# EAGLE design DMFX-2 v1.0 (EAGLE 6.3)
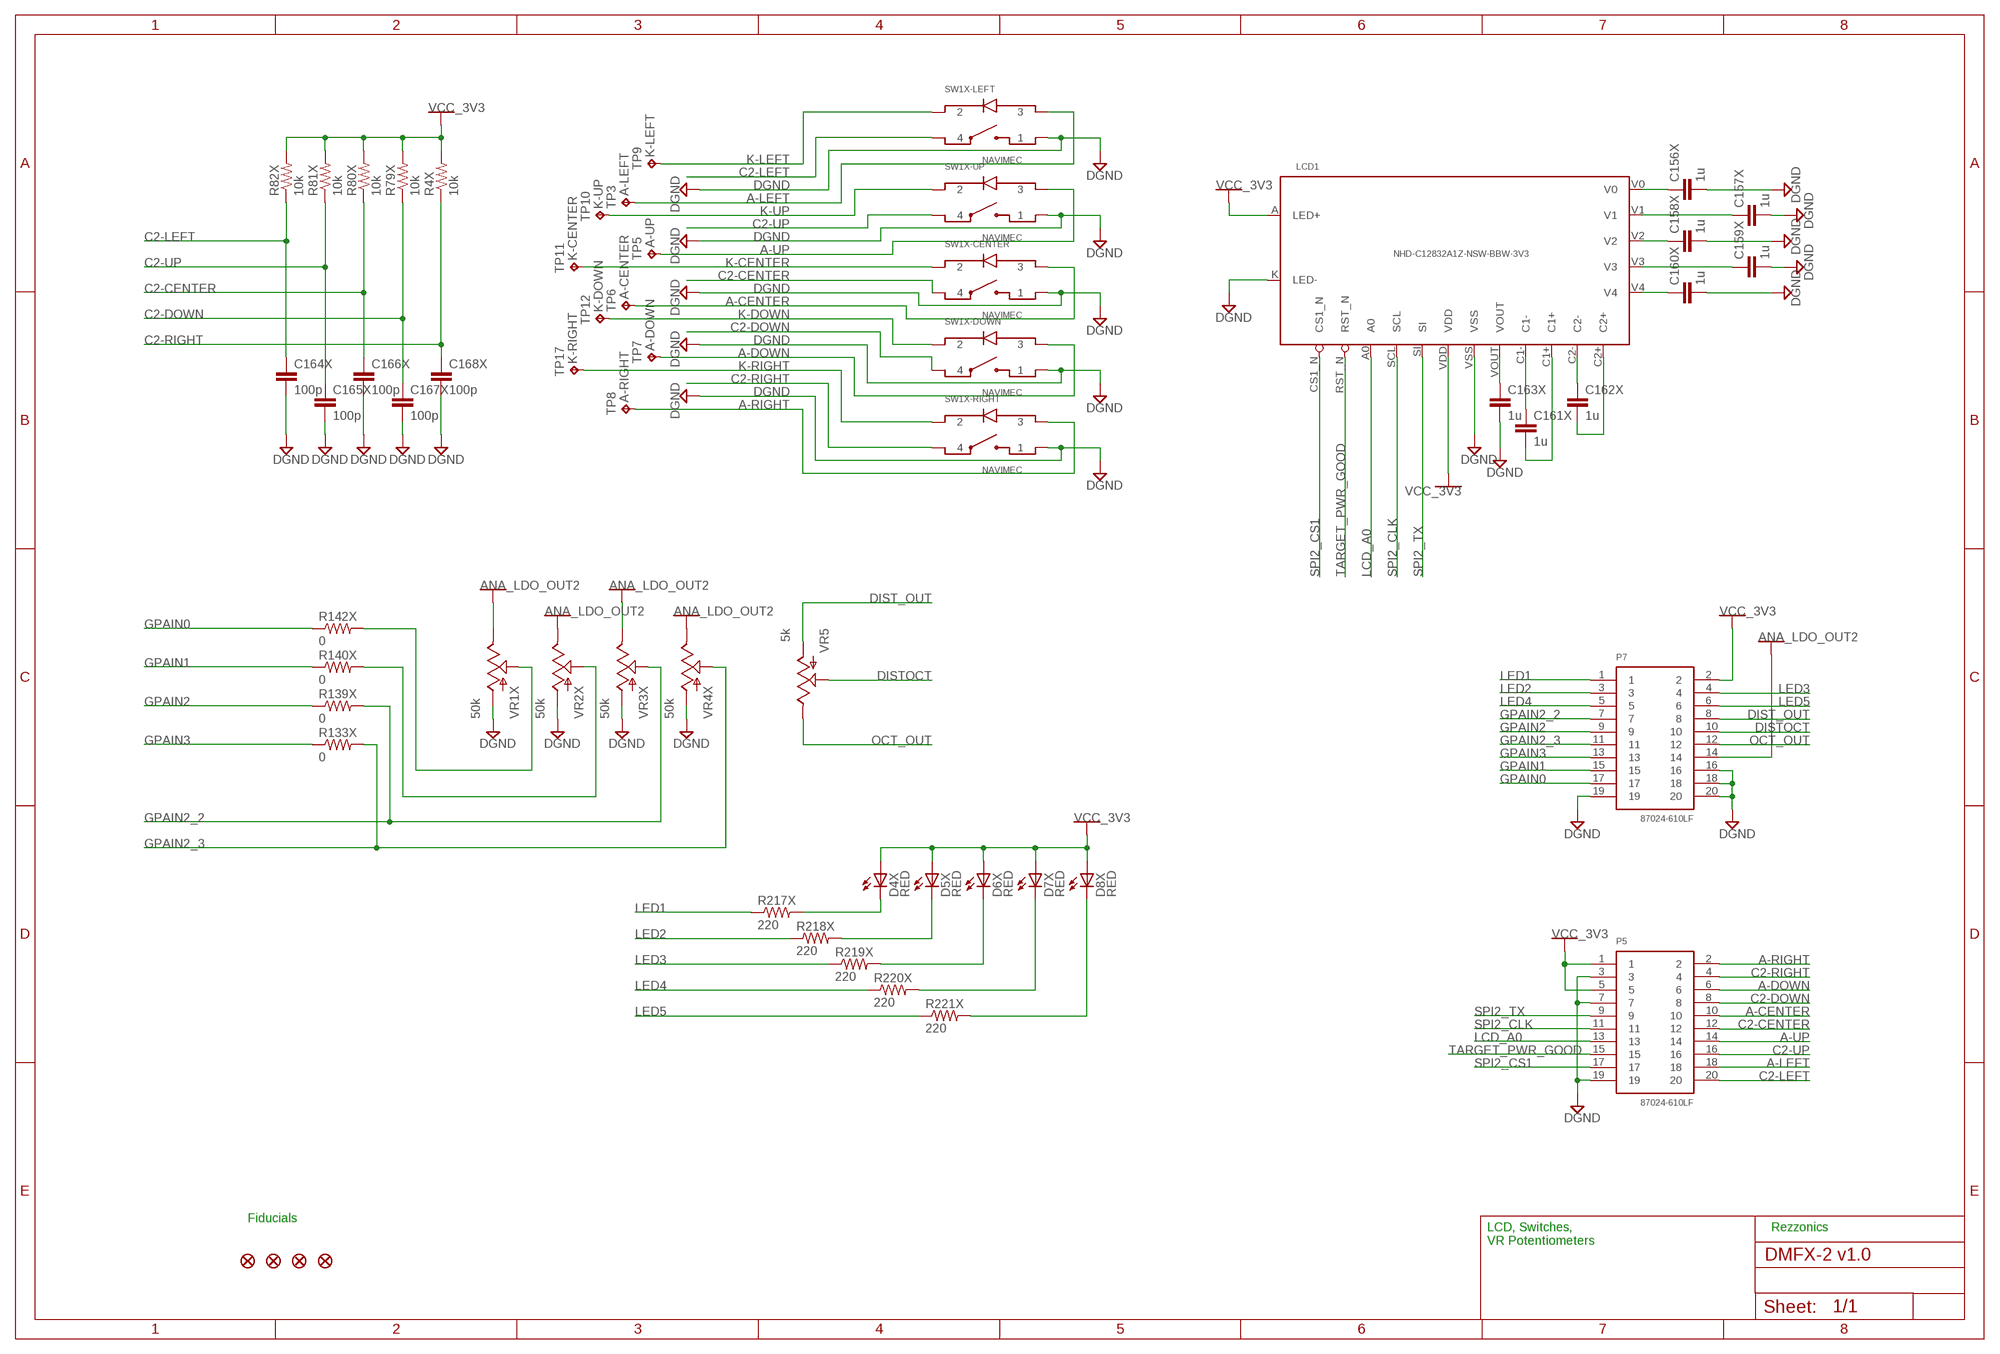
[diagram p0: schematic, sheet 1]

## Parts
C156X  1u  C-EUC0603K  [C0603K]
C157X  1u  C-EUC0603K  [C0603K]
C158X  1u  C-EUC0603K  [C0603K]
C159X  1u  C-EUC0603K  [C0603K]
C160X  1u  C-EUC0603K  [C0603K]
C161X  1u  C-EUC0603K  [C0603K]
C162X  1u  C-EUC0603K  [C0603K]
C163X  1u  C-EUC0603K  [C0603K]
C164X  100p  C-EUC0402  [C0402]
C165X  100p  C-EUC0402  [C0402]
C166X  100p  C-EUC0402  [C0402]
C167X  100p  C-EUC0402  [C0402]
C168X  100p  C-EUC0402  [C0402]
D4X  RED  LED3MM  [LED3MM]
D5X  RED  LED3MM  [LED3MM]
D6X  RED  LED3MM  [LED3MM]
D7X  RED  LED3MM  [LED3MM]
D8X  RED  LED3MM  [LED3MM]
JP2  FIDUCIAL1X2.5  [FIDUCIAL-1X2.5]
JP4  FIDUCIAL1X2.5  [FIDUCIAL-1X2.5]
JP5  FIDUCIAL1X2.5  [FIDUCIAL-1X2.5]
JP9  FIDUCIAL1X2.5  [FIDUCIAL-1X2.5]
LCD1  NHD-C12832A1Z-NSW-BBW-3V3  NHD-C12832A1Z  [NHD-C12832A1Z]
P5  87024-610LF  87022-110LF  [87022-110LF]
P7  87024-610LF  87022-110LF  [87022-110LF]
R4X  10k  RESISTOR0402-RES  [0402-RES]
R79X  10k  RESISTOR0402-RES  [0402-RES]
R80X  10k  RESISTOR0402-RES  [0402-RES]
R81X  10k  RESISTOR0402-RES  [0402-RES]
R82X  10k  RESISTOR0402-RES  [0402-RES]
R133X  0  RESISTOR0402-RES  [0402-RES]
R139X  0  RESISTOR0402-RES  [0402-RES]
R140X  0  RESISTOR0402-RES  [0402-RES]
R142X  0  RESISTOR0402-RES  [0402-RES]
R217X  220  RESISTOR0402-RES  [0402-RES]
R218X  220  RESISTOR0402-RES  [0402-RES]
R219X  220  RESISTOR0402-RES  [0402-RES]
R220X  220  RESISTOR0402-RES  [0402-RES]
R221X  220  RESISTOR0402-RES  [0402-RES]
SW1X  NAVIMEC  1ZX16XLM13609  [1ZW0913611806]
TP3  TPTP12R  [TP12R]
TP5  TPTP12R  [TP12R]
TP6  TPTP12R  [TP12R]
TP7  TPTP12R  [TP12R]
TP8  TPTP12R  [TP12R]
TP9  TPTP12R  [TP12R]
TP10  TPTP12R  [TP12R]
TP11  TPTP12R  [TP12R]
TP12  TPTP12R  [TP12R]
TP17  TPTP12R  [TP12R]
VR1X  50k  POT  [ALPS_POT]
VR2X  50k  POT  [ALPS_POT]
VR3X  50k  POT  [ALPS_POT]
VR4X  50k  POT  [ALPS_POT]
VR5  5k  POT  [ALPS_POT]

## Nets
A-CENTER: P5.10 SW1X.CENTER$3 TP6.TP
A-DOWN: P5.6 SW1X.DOWN$3 TP7.TP
A-LEFT: P5.18 SW1X.LEFT$3 TP3.TP
A-RIGHT: P5.2 SW1X.RIGHT$3 TP8.TP
A-UP: P5.14 SW1X.UP$3 TP5.TP
ANA_LDO_OUT2: P7.14 VR1X.P$1(E) VR2X.P$1(E) VR3X.P$1(E) VR4X.P$1(E)
C2-CENTER: C166X.1 P5.12 R80X.1 SW1X.CENTER$4
C2-DOWN: C167X.1 P5.8 R79X.1 SW1X.DOWN$4
C2-LEFT: C164X.1 P5.20 R82X.1 SW1X.LEFT$4
C2-RIGHT: C168X.1 P5.4 R4X.1 SW1X.RIGHT$4
C2-UP: C165X.1 P5.16 R81X.1 SW1X.UP$4
DGND: C156X.2 C157X.2 C158X.2 C159X.2 C160X.2 C163X.2 C164X.2 C165X.2 C166X.2 C167X.2 C168X.2 LCD1.K(LED-) LCD1.VSS P5.3 P5.7 P5.19 P7.16 P7.18 P7.19 P7.20 SW1X.CENTER$1 SW1X.DOWN$1 SW1X.LEFT$1 SW1X.RIGHT$1 SW1X.UP$1 VR1X.P$3(A) VR2X.P$3(A) VR3X.P$3(A) VR4X.P$3(A)
DIST_OUT: P7.8 VR5.P$3(A)
DISTOCT: P7.10 VR5.P$2(S)
GPAIN0: P7.17 R142X.1
GPAIN1: P7.15 R140X.1
GPAIN2: P7.9 R139X.1
GPAIN2_0: R142X.2 VR1X.P$2(S)
GPAIN2_1: R140X.2 VR2X.P$2(S)
GPAIN2_2: P7.7 R139X.2 VR3X.P$2(S)
GPAIN2_3: P7.11 R133X.2 VR4X.P$2(S)
GPAIN3: P7.13 R133X.1
K-CENTER: SW1X.CENTER$2 TP11.TP
K-DOWN: SW1X.DOWN$2 TP12.TP
K-LEFT: SW1X.LEFT$2 TP9.TP
K-RIGHT: SW1X.RIGHT$2 TP17.TP
K-UP: SW1X.UP$2 TP10.TP
LCD_A0: LCD1.A0 P5.13
LCD_C1+: C161X.2 LCD1.C1+
LCD_C1-: C161X.1 LCD1.C1-
LCD_C2+: C162X.2 LCD1.C2+
LCD_C2-: C162X.1 LCD1.C2-
LCD_V0: C156X.1 LCD1.V0
LCD_V1: C157X.1 LCD1.V1
LCD_V2: C158X.1 LCD1.V2
LCD_V3: C159X.1 LCD1.V3
LCD_V4: C160X.1 LCD1.V4
LCD_VOUT: C163X.1 LCD1.VOUT
LED1: P7.1 R217X.1
LED2: P7.3 R218X.1
LED3: P7.4 R219X.1
LED4: P7.5 R220X.1
LED5: P7.6 R221X.1
N$132: D4X.K(C) R217X.2
N$175: D5X.K(C) R218X.2
N$176: D6X.K(C) R219X.2
N$177: D7X.K(C) R220X.2
N$178: D8X.K(C) R221X.2
OCT_OUT: P7.12 VR5.P$1(E)
SPI2_CLK: LCD1.SCL P5.11
SPI2_CS1: LCD1.CS1_N P5.17
SPI2_TX: LCD1.SI P5.9
TARGET_PWR_GOOD: LCD1.RST_N P5.15
VCC_3V3: D4X.A D5X.A D6X.A D7X.A D8X.A LCD1.A(LED+) LCD1.VDD P5.1 P5.5 P7.2 R4X.2 R79X.2 R80X.2 R81X.2 R82X.2

## Notes on the sheet
- Fiducials
- LCD, Switches,
  VR Potentiometers
- Rezzonics

## Library data of the parts
C156X C157X C158X C159X C160X C161X C162X C163X = resistor:C-EU: CAPACITOR, European symbol; MPN: GRM188R7YA105KA12D
C164X C165X C166X C167X C168X = rcl:C-EU: CAPACITOR, European symbol; MPN: GRM1555C1H101FA01J
D4X D5X D6X D7X D8X = led:LED: LED OSRAM: - CHIPLED LG R971, LG N971, LY N971, LG Q971, LY Q971, LO R971, LY R971 LH N974, LH R974 LS Q976, LO Q976, LY Q976 LO Q996 - Hyper CHIPLED LW Q18S LB Q993, LB Q99A, LB R99A - SideLED LS A670, LO A670, LY A670, LG A670, LP A670 LB A673, LV A673, LT A673, LW A673 LH A674 LY A675 LS A676, LA A676, LO A676, LY A676, LW A676 LS A679, LY A679, LG A679 - Hyper Micro SIDELED® LS Y876, LA Y876, LO Y876, LY Y876 LT Y87S - SmartLED LW L88C, LW L88S LB L89C, LB L89S, LG L890 LS L89K, LO L89K, LY L89K LS L896, LA L896, LO L896, LY L896 - TOPLED LS T670, LO T670, LY T670, LG T670, LP T670 LSG T670, LSP T670, LSY T670, LOP T670, LYG T670 LG T671, LOG T671, LSG T671 LB T673, LV T673, LT T673, LW T673 LH T674 LS T676, LA T676, LO T676, LY T676, LB T676, LH T676, LSB T676, LW T676 LB T67C, LV T67C, LT T67C, LS T67K, LO T67K, LY T67K, LW E67C LS E67B, LA E67B, LO E67B, LY E67B, LB E67C, LV E67C, LT E67C LW T67C LS T679, LY T679, LG T679 LS T770, LO T770, LY T770, LG T770, LP T770 LB T773, LV T773, LT T773, LW T773 LH T774 LS E675, LA E675, LY E675, LS T675 LS T776, LA T776, LO T776, LY T776, LB T776 LHGB T686 LT T68C, LB T68C - Hyper Mini TOPLED® LB M676 - Mini TOPLED Santana® LG M470 LS M47K, LO M47K, LY M47K Source: http://www.osram.convergy.de LUXEON: - LUMILED® LXK2-PW12-R00, LXK2-PW12-S00, LXK2-PW14-U00, LXK2-PW14-V00 LXK2-PM12-R00, LXK2-PM12-S00, LXK2-PM14-U00 LXK2-PE12-Q00, LXK2-PE12-R00, LXK2-PE12-S00, LXK2-PE14-T00, LXK2-PE14-U00 LXK2-PB12-K00, LXK2-PB12-L00, LXK2-PB12-M00, LXK2-PB14-N00, LXK2-PB14-P00, LXK2-PB14-Q00 LXK2-PR12-L00, LXK2-PR12-M00, LXK2-PR14-Q00, LXK2-PR14-R00 LXK2-PD12-Q00, LXK2-PD12-R00, LXK2-PD12-S00 LXK2-PH12-R00, LXK2-PH12-S00 LXK2-PL12-P00, LXK2-PL12-Q00, LXK2-PL12-R00 Source: www.luxeon.com KINGBRIGHT: KA-3528ASYC Source: www.kingbright.com; MPN: LTL-4222N
JP2 JP4 JP5 JP9 = SparkFun:FIDUCIAL: Fiducial Alignment Points Various fiducial points for machine vision alignment.; MPN: *
LCD1 = rezzonics:NHD-C12832A1Z: COG LCD Module Newhaven Display NHD-C12832A1Z NHD-C12832A1Z-NSW-BBW-3V3 <ikey.com/product-detail/en/NHD-C12832A1Z-NSW-BBW-3V3/NHD-C12832A1Z-NSW-BBW-3V3-ND/2059235>; MPN: NHD-C12832A1Z-NSW-BBW-3V3
P5 P7 = rezzonics:87022-110LF: FCI 87022-610LF <http://www.digikey.com/product-detail/en/87022-610LF/87022-610LF-ND/1525688> CONN RECPT 20POS .050" SMT DUAL; MPN: 87024-610LF
R4X R79X R80X R81X R82X = SparkFun:RESISTOR: Resistor Basic schematic elements and footprints for 0603, 1206, and PTH resistors.; MPN: ERJ-2RKF1002X
R133X R139X R140X R142X = SparkFun:RESISTOR: Resistor Basic schematic elements and footprints for 0603, 1206, and PTH resistors.; MPN: ERJ-2GE0R00X
R217X R218X R219X R220X R221X = SparkFun:RESISTOR: Resistor Basic schematic elements and footprints for 0603, 1206, and PTH resistors.; MPN: ERJ-2RKF2200X
SW1X = rezzonics:1ZX16XLM13609: MEC Navimec 1ZB/1ZCS Illuminated Module 4x1ZB16DLM13609 + 1ZC16LM11809 + 5x 5GTH9/LEDs CAP TACTILE 1/4 RING FRSTD WHITE + CAP TACTILE ROUND FROSTED WHITE + SWITCH TACTILE SPST-NO 0.05A 24V; MPN: 1ZW0913611806
TP3 = testpad:TP: Test pad; MPN: *; TP_SIGNAL_NAME: A-LEFT
TP5 = testpad:TP: Test pad; MPN: *; TP_SIGNAL_NAME: A-UP
TP6 = testpad:TP: Test pad; MPN: *; TP_SIGNAL_NAME: A-CENTER
TP7 = testpad:TP: Test pad; MPN: *; TP_SIGNAL_NAME: A-DOWN
TP8 = testpad:TP: Test pad; MPN: *; TP_SIGNAL_NAME: A-RIGHT
TP9 = testpad:TP: Test pad; MPN: *; TP_SIGNAL_NAME: K-LEFT
TP10 = testpad:TP: Test pad; MPN: *; TP_SIGNAL_NAME: K-UP
TP11 = testpad:TP: Test pad; MPN: *; TP_SIGNAL_NAME: K-CENTER
TP12 = testpad:TP: Test pad; MPN: *; TP_SIGNAL_NAME: K-DOWN
TP17 = testpad:TP: Test pad; MPN: *; TP_SIGNAL_NAME: K-RIGHT
VR1X VR2X VR3X VR4X = SparkFun:POT; MPN: EVU-F2AF30B54
VR5 = SparkFun:POT; MPN: EVU-F2AF30B53

## Board
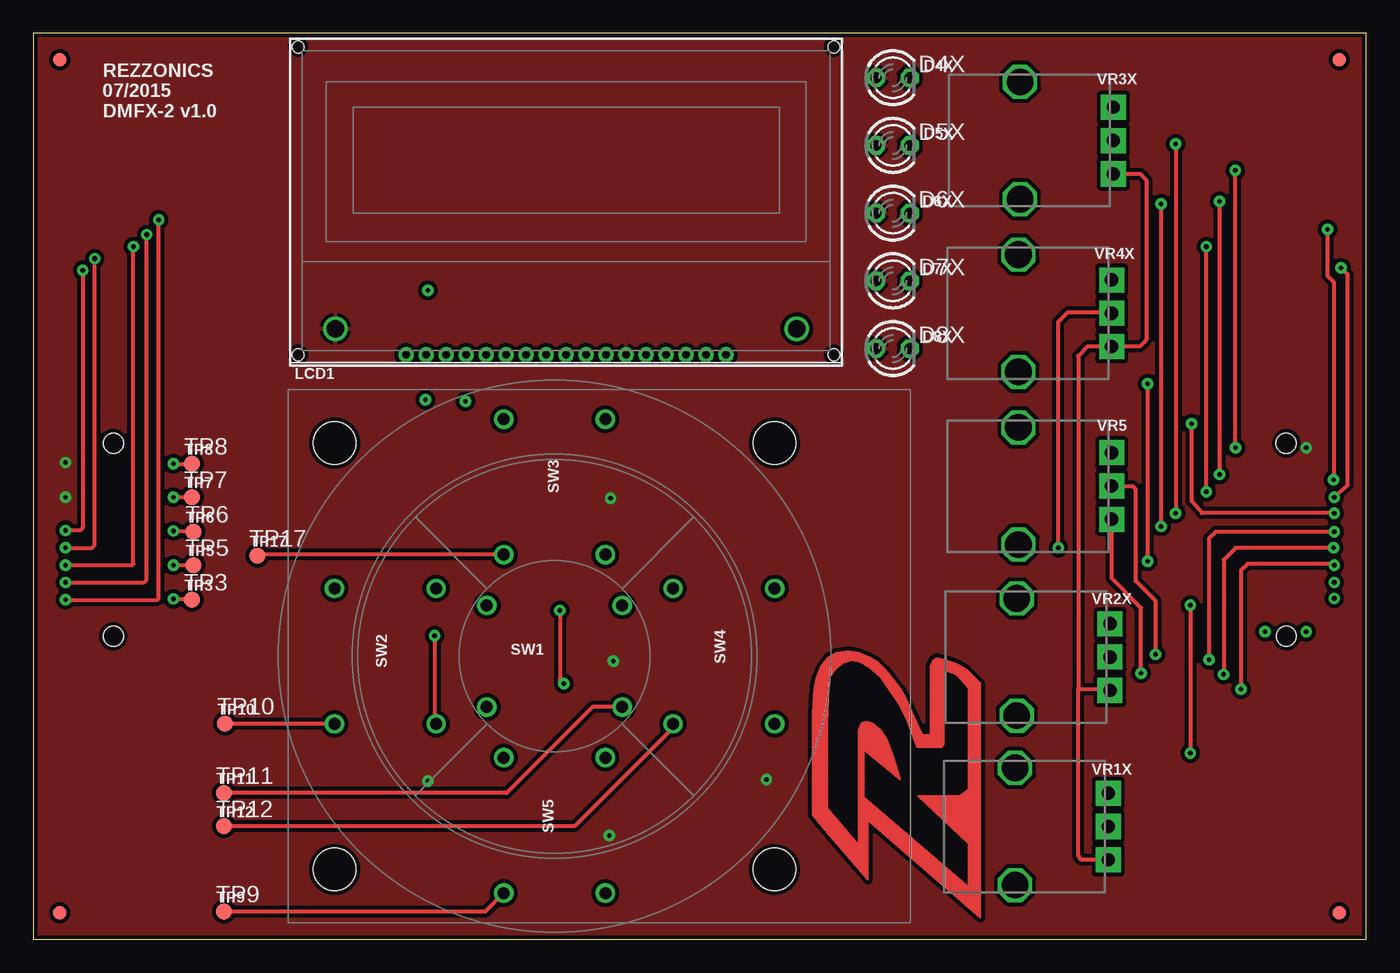
[diagram p1: board, top side]
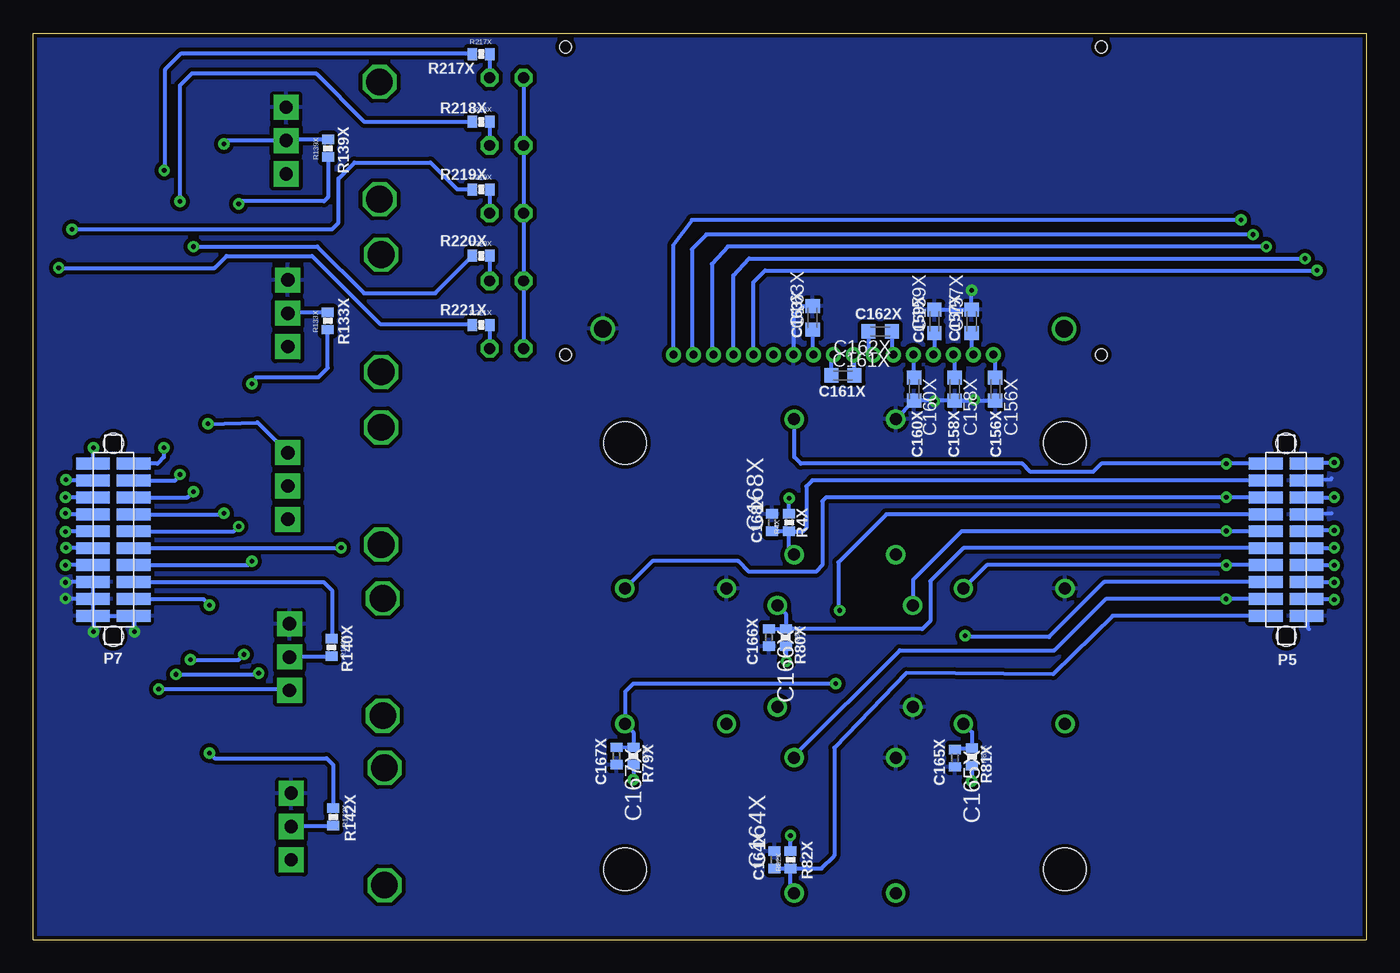
[diagram p2: board, bottom side, seen from below]

Size 100 x 68 mm. Coordinates in mm from the lower left corner, seen from the top.
Outline: 0,68 0,0 100,0 100,68 0,68
Copper layers (1*16): Top 0.035mm / dielectric 1.53mm / Bottom 0.035mm
Design rules "default *": minimum track width 0.3mm, minimum drill 0.35mm, track to track 0.3mm, track to pad 0.3mm, pad to pad 0.3mm, via to via 0.3mm, smd to smd 0.3mm, copper to edge 8mil, drill to drill 4mil, minimum pad ring 0.275mm, minimum via ring 0.25mm, stop-mask expansion 2mil, vias tented up to drill 0mil, thermal gap 10mil

### Footprints (pad centres in the part's own frame; a part is rotated, then mirrored left to right if it is on the bottom)
C0603K = smd 1.05 x 1.08: 1 -0.875,0; 2 0.875,0
C0402 = smd 0.7 x 0.9: 1 -0.65,0; 2 0.65,0
LED3MM = drill 0.813 octagon: A -1.27,0; K 1.27,0
FIDUCIAL-1X2.5 = smd 1 x 1: 1 0,0
NHD-C12832A1Z = drill 1.3: A -17.3,1.95; K 17.3,1.95 | drill 0.6: A0 9,0; C1+ -1.5,0; C1- 0,0; C2+ -3,0; C2- -4.5,0; CS1_N 12,0; RST_N 10.5,0; SCL 7.5,0; SI 6,0; V0 -12,0; V1 -10.5,0; V2 -9,0; V3 -7.5,0; V4 -6,0; VDD 4.5,0; VOUT 1.5,0; VSS 3,0 | hole 0.9: -20.1,0; 20.1,0; 20.1,23.1; -20.1,23.1
87022-110LF = smd 0.889 x 2.54: 1 5.715,-1.524; 2 5.715,1.524; 3 4.445,-1.524; 4 4.445,1.524; 5 3.175,-1.524; 6 3.175,1.524; 7 1.905,-1.524; 8 1.905,1.524; 9 0.635,-1.524; 10 0.635,1.524; 11 -0.635,-1.524; 12 -0.635,1.524; 13 -1.905,-1.524; 14 -1.905,1.524; 15 -3.175,-1.524; 16 -3.175,1.524; 17 -4.445,-1.524; 18 -4.445,1.524; 19 -5.715,-1.524; 20 -5.715,1.524 | hole 1.5: -7.239,0 | hole 1.524: 7.239,0
0402-RES = smd 0.7 x 0.9: 1 -0.65,0; 2 0.65,0
1ZW0913611806 = drill 0.9: CENTER$1 -3.81,5.08; CENTER$2 -3.81,-5.08; CENTER$3 3.81,5.08; CENTER$4 3.81,-5.08; DOWN$1 5.08,-8.89; DOWN$2 -5.08,-8.89; DOWN$3 5.08,-16.51; DOWN$4 -5.08,-16.51; LEFT$1 -7.62,3.81; LEFT$2 -17.78,3.81; LEFT$3 -7.62,-3.81; LEFT$4 -17.78,-3.81; RIGHT$1 17.78,3.81; RIGHT$2 7.62,3.81; RIGHT$3 17.78,-3.81; RIGHT$4 7.62,-3.81; UP$1 5.08,16.51; UP$2 -5.08,16.51; UP$3 5.08,8.89; UP$4 -5.08,8.89 | hole 3.2: 16,16.5; -16,16.5; 16,-16.5; -16,-16.5
TP12R = smd 1.2 x 1.2: TP 0,0
ALPS_POT = drill 1 pad 1.88 square: P$1 7,-2.5; P$2 7,0; P$3 7,2.5 | drill 2 octagon: P$4 0,-4.4; P$5 0,4.4

### Placement (x,y rotation side)
C156X  27.82,41.31 270 bottom
C157X  29.6,46.39 90 bottom
C158X  30.87,41.31 270 bottom
C159X  32.4,46.39 90 bottom
C160X  33.92,41.31 270 bottom
C161X  39.25,42.32 0 bottom
C162X  36.46,45.62 180 bottom
C163X  41.54,46.64 90 bottom
C164X  44.41,5.98 90 bottom
C165X  30.85,13.61 270 bottom
C166X  44.82,22.66 270 bottom
C167X  56.25,13.77 270 bottom
C168X  44.56,31.29 90 bottom
D4X  64.49,64.67 0 top
D5X  64.49,59.59 0 top
D6X  64.49,54.51 0 top
D7X  64.49,49.43 0 top
D8X  64.49,44.35 0 top
JP2  1.98,66.02 0 top
JP4  1.98,2.02 0 top
JP5  97.98,66.02 0 top
JP9  97.98,2.02 0 top
LCD1  39.97,43.88 0 top
P5  6,30 90 bottom
P7  94,30 90 bottom
R4X  43.3,31.29 90 bottom
R79X  54.98,13.77 270 bottom
R80X  43.55,22.66 270 bottom
R81X  29.58,13.71 270 bottom
R82X  43.18,5.98 90 bottom
R133X  77.91,46.42 90 bottom
R139X  77.88,59.38 90 bottom
R140X  77.64,21.92 270 bottom
R142X  77.5,9.2 270 bottom
R217X  66.4,66.44 0 bottom
R218X  66.4,61.37 0 bottom
R219X  66.4,56.28 0 bottom
R220X  66.4,51.3 0 bottom
R221X  66.4,46.12 0 bottom
SW1X  39.1,21.26 90 top
TP3  11.9,25.5 0 top
TP5  12,28.1 0 top
TP6  12,30.6 0 top
TP7  11.9,33.2 0 top
TP8  11.9,35.7 0 top
TP9  14.3,2.1 0 top
TP10  14.38,16.2 0 top
TP11  14.3,11 0 top
TP12  14.3,8.5 0 top
TP17  16.8,28.8 0 top
U$1  [REZZLOGO]  67.3,12.8 90 top
VR1X  73.65,8.48 0 top
VR2X  73.78,21.2 0 top
VR3X  74.03,59.95 0 top
VR4X  73.91,46.99 0 top
VR5  73.91,34.03 0 top

### Tracks (layer width: path | path; a pad name or v marks a point on that pad's centre or on a via)
A-CENTER  (via drill 0.35 pad 0.45)
  Top 0.3: v10.5,30.65 11.55,30.65 TP6.TP
  Bottom 0.3: P5.10 10.52,30.64 | 10.52,30.64 30.36,30.64 34,27 34,25.09 SW1X.CENTER$3 | 10.52,30.64 10.52,30.62 v10.5,30.65
A-DOWN  (via drill 0.35 pad 0.45)
  Top 0.3: v10.5,33.2 TP7.TP
  Bottom 0.3: SW1X.DOWN$3 53.55,28.4 47.1,28.4 46.3,27.6 41.3,27.6 40.8,28.1 40.8,32.9 40.52,33.17 P5.6 10.47,33.17 v10.5,33.2
A-LEFT  (via drill 0.35 pad 0.45)
  Top 0.3: v10.51,25.55 11.64,25.55 TP3.TP
  Bottom 0.3: P5.18 v10.51,25.55 | v10.51,25.55 19.55,25.55 23.4,21.7 35,21.7 42.91,13.79 SW1X.LEFT$3 | v10.51,25.55 v10.51,25.54 v10.5,25.55
A-RIGHT  (via drill 0.35 pad 0.45)
  Top 0.3: v10.5,35.7 TP8.TP
  Bottom 0.3: P5.2 10.48,35.72 | 10.48,35.72 19.89,35.72 20.5,35.1 25.18,35.1 25.8,35.72 42.41,35.72 42.9,36.2 42.9,39.02 SW1X.RIGHT$3 | 10.48,35.72 v10.5,35.7
A-UP  (via drill 0.35 pad 0.45)
  Top 0.3: v10.5,28.1 TP5.TP
  Bottom 0.3: P5.14 v10.51,28.09 | v10.51,28.09 28.46,28.09 SW1X.UP$3 | v10.51,28.09 v10.5,28.1
ANA_LDO_OUT2  (via drill 0.35 pad 0.45)
  Top 0.3: v97.6,28.1 97.4,28.2 91.1,28.2 90.6,27.7 v90.6,18.8 | 78.4,18.8 78.4,43.8 79.09,44.49 VR4X.P$1 83,44.5 83.5,45 83.5,57 83.05,57.45 VR3X.P$1 | 78.4,18.8 80.68,18.8 VR2X.P$1 | VR1X.P$1 80.62,5.98 80.6,6 78.6,6 78.4,6.3 78.4,18.8
  Bottom 0.3: P7.14 v97.61,28.09 v97.6,28.1 | v90.6,18.8 80.89,18.8 VR2X.P$1
C2-CENTER
  Bottom 0.3: C166X.1 44.77,23.31 R80X.1 | SW1X.CENTER$4 43.55,24.43 R80X.1 | P5.12 30.23,29.36 32.7,26.9 32.7,23.9 33.3,23.3 R80X.1
C2-DOWN  (via drill 0.35 pad 0.45)
  Top 0.3: 39.6,19.4 v39.8,19.2 39.5,19.5 v39.5,24.7
  Bottom 0.3: C167X.1 55.03,14.37 R79X.1 54.98,15.54 SW1X.DOWN$4 55.6,16.19 55.6,18.6 55,19.2 v39.8,19.2 | P5.8 35.99,31.91 39.6,28.3 39.6,24.8 v39.5,24.7
C2-LEFT
  Bottom 0.3: C164X.1 44.36,5.33 R82X.1 | SW1X.LEFT$4 43.18,3.75 R82X.1 | P5.20 19.02,24.29 23.5,19.9 34.5,20 39.9,14.4 39.9,6.3 40.87,5.33 R82X.1
C2-RIGHT
  Bottom 0.3: C168X.1 44.52,30.64 R4X.1 | SW1X.RIGHT$4 43.3,29.26 R4X.1 | P5.4 41.55,34.45 42,34 42,30.9 42.3,30.6 43.25,30.6 R4X.1
C2-UP  (via drill 0.35 pad 0.45)
  Top 0.3: v30.1,22.8 30.1,16.29 SW1X.UP$4
  Bottom 0.3: C165X.1 30.8,14.36 R81X.1 29.58,15.54 SW1X.UP$4 | P5.16 19.68,26.82 23.8,22.7 30,22.7 v30.1,22.8
DGND  (via drill 0.35 pad 0.45)
  Bottom 0.3: P7.20 P7.19 92.38,23.32 v92.4,23.1 | P7.20 P7.18 | P7.18 P7.16 97.17,26.82 v97.6,26.8 | P7.20 95.42,23.32 v95.5,23.1 | P7.18 97.25,25.55 v97.6,25.6 | P5.19 4.38,23.38 4.3,23.3 | P5.7 2.6,32.01 2.6,32 | P5.3 2.65,34.55 2.6,34.6 | C159X.2 C157X.2 29.6,48.5 v29.6,48.7 | C158X.2 C156X.2 | C158X.2 32.4,40.43 | 32.4,40.43 C160X.2 35.29,39.06 SW1X.RIGHT$1 | C158X.2 29.47,40.43 v29.4,40.5 | 32.4,40.43 v32.4,40.4 | C163X.2 41.55,47.5 42.3,47.5 42.97,46.83 LCD1.VSS
  pour Bottom (isolate 0.3): 0,68 100,68 100,0 0,0
DIST_OUT  (via drill 0.35 pad 0.45)
  Top 0.3: v97.6,32 87.7,32 86.9,32.9 v86.9,38.7
  Bottom 0.3: P7.8 97.5,31.91 v97.6,32 | v86.9,38.7 83.18,38.8 VR5.P$3
DISTOCT  (via drill 0.35 pad 0.45)
  Top 0.3: v97.6,30.6 88.7,30.6 88.2,30.1 v88.2,21 | v84.2,21.4 84.2,25.4 82.7,26.9 82.7,33.78 82.48,34 80.94,34 VR5.P$2
  Bottom 0.3: P7.10 97.56,30.64 v97.6,30.6 | v88.2,21 84.6,21 v84.2,21.4
GPAIN0  (via drill 0.35 pad 0.45)
  Top 0.3: v86.8,25.1 v86.8,14
  Bottom 0.3: P7.17 87.25,25.55 v86.8,25.1 | v86.8,14 86.4,13.6 78,13.6 77.5,13.1 R142X.1
GPAIN1
  Bottom 0.3: P7.15 78.22,26.82 77.6,26.2 77.6,22.61 R140X.1
GPAIN2  (via drill 0.35 pad 0.45)
  Top 0.3: v84.6,55.2 v84.6,31
  Bottom 0.3: P7.9 84.97,30.64 v84.6,31 | R139X.1 77.88,55.72 78.2,55.4 84.4,55.4 v84.6,55.2
GPAIN2_0
  Bottom 0.3: R142X.2 77.58,8.48 VR1X.P$2
GPAIN2_1
  Bottom 0.3: R140X.2 77.71,21.2 VR2X.P$2
GPAIN2_2  (via drill 0.35 pad 0.45)
  Top 0.3: v85.7,59.7 v85.7,32
  Bottom 0.3: R139X.2 80.96,60.03 VR3X.P$2 85.45,59.95 v85.7,59.7 | P7.7 85.81,31.91 v85.7,32
GPAIN2_3  (via drill 0.35 pad 0.45)
  Top 0.3: v76.9,29.4 76.9,46.37 77.6,47.07 80.84,47.07 VR4X.P$2
  Bottom 0.3: VR4X.P$2 80.84,47.07 R133X.2 | P7.11 77.64,29.36 v76.9,29.4
GPAIN3  (via drill 0.35 pad 0.45)
  Top 0.3: v83.6,28.4 v83.6,41.7
  Bottom 0.3: P7.13 83.91,28.09 v83.6,28.4 | v83.6,41.7 83.3,42.2 78.6,42.2 77.9,42.9 77.9,45.76 R133X.1
K-CENTER
  Top 0.3: SW1X.CENTER$2 41.95,17.45 35.5,11 TP11.TP
K-DOWN
  Top 0.3: SW1X.DOWN$2 47.99,15.89 40.6,8.5 TP12.TP
K-LEFT
  Top 0.3: SW1X.LEFT$2 35.29,3.49 | 35.29,3.49 35.3,3.5 | 35.29,3.49 33.9,2.1 TP9.TP
K-RIGHT
  Top 0.3: SW1X.RIGHT$2 16.88,28.88 TP17.TP
K-UP
  Top 0.3: SW1X.UP$2 14.4,16.18 TP10.TP
LCD_A0  (via drill 0.35 pad 0.45)
  Top 0.3: v2.4,28.1 7.4,28.1 7.5,28.2 v7.5,52
  Bottom 0.3: P5.13 2.6,28.09 v2.4,28.1 | v7.5,52 47.9,52 49.1,50.7 49.1,44.01 LCD1.A0
LCD_C1+
  Bottom 0.3: C161X.2 38.38,43.79 LCD1.C1+
LCD_C1-
  Bottom 0.3: C161X.1 40.13,43.73 LCD1.C1-
LCD_C2+
  Bottom 0.3: C162X.2 37.33,44.25 LCD1.C2+
LCD_C2-
  Bottom 0.3: C162X.1 35.58,44 LCD1.C2-
LCD_V0
  Bottom 0.3: C156X.1 27.82,43.73 LCD1.V0
LCD_V1
  Bottom 0.3: C157X.1 29.6,44.01 LCD1.V1
LCD_V2
  Bottom 0.3: C158X.1 30.87,43.78 LCD1.V2
LCD_V3
  Bottom 0.3: C159X.1 32.4,43.96 LCD1.V3
LCD_V4
  Bottom 0.3: C160X.1 33.92,43.83 LCD1.V4
LCD_VOUT
  Bottom 0.3: C163X.1 41.54,43.95 LCD1.VOUT
LED1  (via drill 0.35 pad 0.45)
  Top 0.3: v90.18,57.72 90.18,36.8 v90.2,36.9
  Bottom 0.3: v90.18,57.72 90.1,57.8 90.1,65.3 88.9,66.5 67.11,66.5 R217X.1 | v90.2,36.9 90.2,36.2 90.69,35.72 P7.1
LED2  (via drill 0.35 pad 0.45)
  Top 0.3: v89,34.9 v89,55.4
  Bottom 0.3: P7.3 89.36,34.45 v89,34.9 | v89,55.4 89,64.1 88.1,65 78.8,65 75.17,61.37 R218X.1
LED3  (via drill 0.35 pad 0.45)
  Top 0.3: v97.55,34.5 97.6,34.45 97.6,49.3 97.1,49.8 v97.1,53.3
  Bottom 0.3: P7.4 97.25,34.45 v97.55,34.5 | v97.1,53.3 77.6,53.3 77.1,53.8 77.1,57.1 75.9,58.3 70.2,58.3 68.2,56.3 67.06,56.3 R219X.1
LED4  (via drill 0.35 pad 0.45)
  Top 0.3: v88,33.6 v88,52
  Bottom 0.3: P7.5 88.42,33.17 v88,33.6 | v88,52 78.7,52 75.2,48.5 69.86,48.5 R220X.1
LED5  (via drill 0.35 pad 0.45)
  Top 0.3: v97.6,33.2 98.6,34.1 98.6,49.9 v98.1,50.4
  Bottom 0.3: P7.6 97.53,33.17 v97.6,33.2 | v98.1,50.4 86.4,50.4 85.5,51.3 79.1,51.3 74,46.2 67.12,46.2 R221X.1
N$132
  Bottom 0.3: D4X.K R217X.2
N$175
  Bottom 0.3: D5X.K R218X.2
N$176
  Bottom 0.3: D6X.K R219X.2
N$177
  Bottom 0.3: D7X.K R220X.2
N$178
  Bottom 0.3: D8X.K R221X.2
OCT_OUT  (via drill 0.35 pad 0.45)
  Top 0.3: v97.55,29.4 90.2,29.4 89.3,28.5 v89.3,19.9 | v83.1,20 83.1,24.9 80.9,27.1 80.9,31.52 VR5.P$1 80.94,31.5
  Bottom 0.3: P7.12 97.36,29.36 v97.55,29.4 | v89.3,19.9 83.3,19.9 v83.1,20
SPI2_CLK  (via drill 0.35 pad 0.45)
  Top 0.3: v2.4,29.4 4.4,29.4 4.6,29.6 v4.6,51.1
  Bottom 0.3: LCD1.SCL 47.47,49.83 46.3,51.1 v4.6,51.1 | P5.11 2.63,29.36 v2.4,29.4
SPI2_CS1  (via drill 0.35 pad 0.45)
  Top 0.3: v2.4,25.5 9.3,25.5 9.4,25.6 v9.4,54
  Bottom 0.3: P5.17 2.56,25.55 v2.4,25.5 | v9.4,54 50.6,54 52,52.1 52,43.91 LCD1.CS1_N
SPI2_TX  (via drill 0.35 pad 0.45)
  Top 0.3: v3.7,50.2 3.7,30.9 3.5,30.7 v2.4,30.7
  Bottom 0.3: LCD1.SI 45.97,49.33 45.1,50.2 v3.7,50.2 | v2.4,30.7 4.31,30.7 P5.9
TARGET_PWR_GOOD  (via drill 0.35 pad 0.45)
  Top 0.3: v2.4,26.8 8.3,26.8 8.5,27 v8.5,52.9
  Bottom 0.3: P5.15 2.62,26.82 v2.4,26.8 | v8.5,52.9 49.5,52.9 50.6,51.8 50.6,44.01 LCD1.RST_N
VCC_3V3  (via drill 0.35 pad 0.45)
  Bottom 0.3: P5.1 4.29,35.81 4.3,35.8 v2.4,35.8 | P5.5 2.52,33.17 v2.4,33.2 | P7.2 95.52,36.72 v95.5,36.9 | D4X.A D5X.A D6X.A D7X.A D8X.A | R80X.2 43.55,21.25 v43.5,20.9 | R4X.2 43.3,32.9 v43.3,33.1 | R82X.2 43.18,7.38 v43.2,7.8 | R79X.2 54.98,12.32 v55,12 | R81X.2 29.58,12.12 v29.6,11.9
  pour Top (isolate 0.3): 0,68 100,68 100,0 0,0

### Text on the board
_tsilk: D4X | VR3X | REZZONICS / 07/2015 / DMFX-2 v1.0 | D5X | D6X | VR4X | D7X | D8X | LCD1 | VR5 | TP8 | TP7 | SW3 | TP6 | TP5 | TP17 | TP3 | VR2X | SW1 | SW4 | SW2 | TP10 | TP11 | VR1X | TP12 | SW5 | TP9
_bsilk: R217X | R218X | R139X | R219X | R220X | R133X | C162X | R221X | C157X | C159X | C163X | C161X | C156X | C158X | C160X | R4X | C168X | R80X | R140X | P5 | C166X | P7 | R81X | R79X | C165X | C167X | R142X | R82X | C164X